# EAGLE design ProtoBIT (EAGLE 7.3.0)
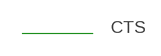
[diagram p0: schematic, sheet 1, part 1 of 2]
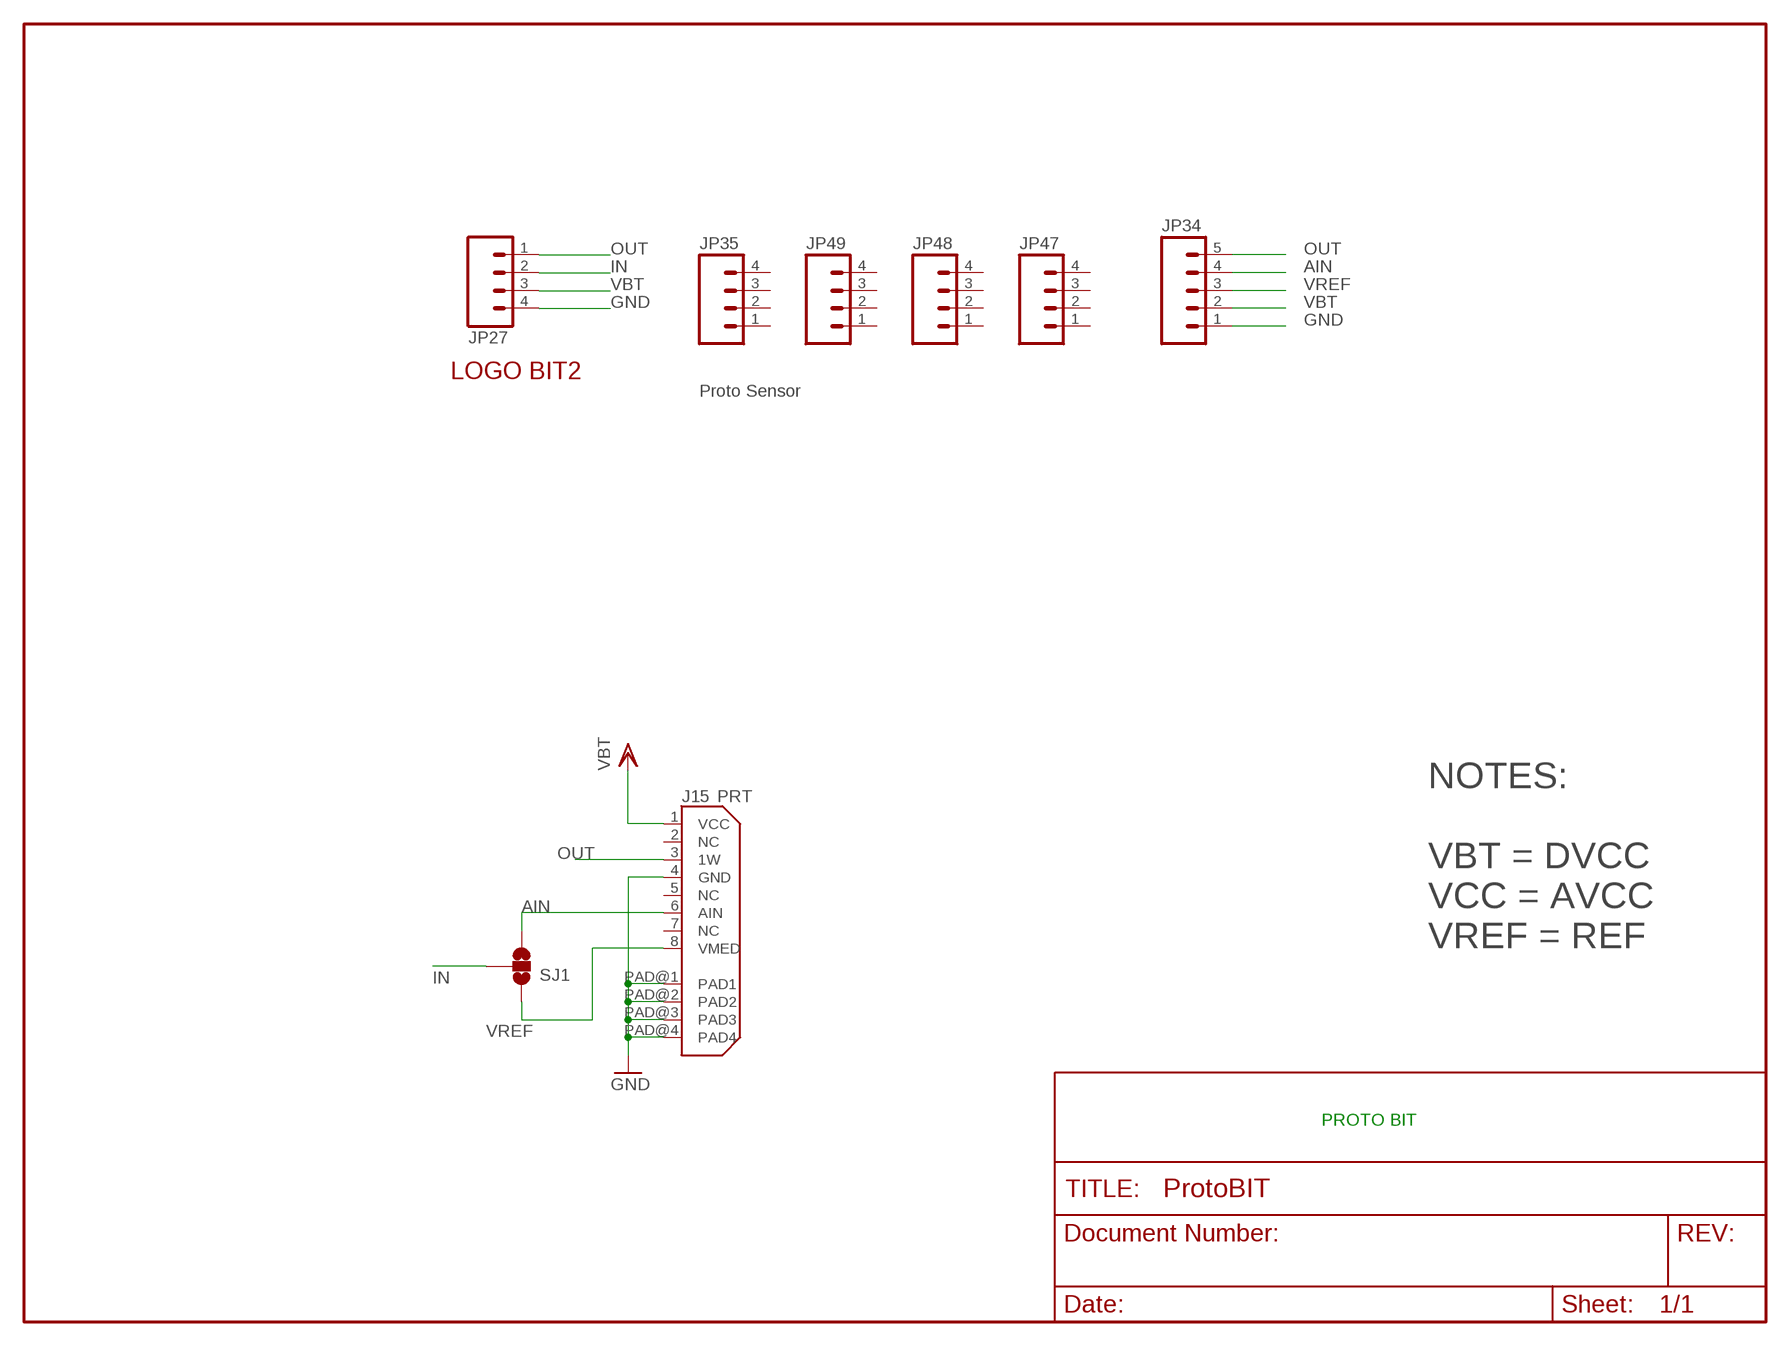
[diagram p1: schematic, sheet 1, part 2 of 2]

## Parts
J15  PRT  ANALOG_CONN_COMTEK_8PINSMD  [8PIN_MINI_USB_SINGLE_ROW_SMD]
JP27  M04JST-PTH  [JST-4-PTH]
JP34  M05  [JST-5-PTH-NO_SILK]
JP35  M04PTH  [1X04]
JP47  M04PTH  [1X04]
JP48  M04PTH  [1X04]
JP49  M04PTH  [1X04]
SJ1  SOLDERJUMPER_2WAYS  [SJ_3]
U$14  LOGO_BIT2(4.72X3.78)  [LOGO_BIT2]

## Nets
AIN: J15.6(AIN) JP34.4 SJ1.3
GND: J15.4(GND) J15.PAD@1(PAD1) J15.PAD@2(PAD2) J15.PAD@3(PAD3) J15.PAD@4(PAD4) JP27.4 JP34.1
IN: JP27.2 SJ1.2
OUT: J15.3(1W) JP27.1 JP34.5
VBT: J15.1(VCC) JP27.3 JP34.2
VREF: J15.8(VMED) JP34.3 SJ1.1
Unconnected: J15.2(NC) J15.5(NC) J15.7(NC) JP35.1 JP35.2 JP35.3 JP35.4 JP47.1 JP47.2 JP47.3 JP47.4 JP48.1 JP48.2 JP48.3 JP48.4 JP49.1 JP49.2 JP49.3 JP49.4

## Notes on the sheet
- Proto Sensor
- NOTES:
  
  VBT = DVCC
  VCC = AVCC
  VREF = REF
- PROTO BIT

## Library data of the parts
J15 = BioPlux2_connectors:ANALOG_CONN_COMTEK_8PIN
JP27 = SparkFun:M04: Header 4 Standard 4-pin 0.1" header. Use with straight break away headers (SKU : PRT-00116), right angle break away headers (PRT-00553), swiss pins (PRT-00743), machine pins (PRT-00117), and female headers (PRT-00115). Molex polarized connector foot print use with SKU : PRT-08231 with associated crimp pins and housings. 1MM SMD Version SKU: PRT-10208
JP34 = SparkFun-Connectors:M05: Header 5 Standard 5-pin 0.1" header. Use with straight break away headers (SKU : PRT-00116), right angle break away headers (PRT-00553), swiss pins (PRT-00743), machine pins (PRT-00117), and female headers (PRT-00115). Molex polarized connector foot print use with SKU : PRT-08230 with associated crimp pins and housings.
JP35 JP47-JP49 = SparkFun-Connectors:M04: Header 4 Standard 4-pin 0.1" header. Use with straight break away headers (SKU : PRT-00116), right angle break away headers (PRT-00553), swiss pins (PRT-00743), machine pins (PRT-00117), and female headers (PRT-00115). Molex polarized connector foot print use with SKU : PRT-08231 with associated crimp pins and housings. 1MM SMD Version SKU: PRT-10208
SJ1 = SparkFun-Retired:SOLDERJUMPER_2WAY: Solder Jumper 2 way solder jumper
U$14 = bit2_logo_27x8:LOGO_BIT2(4.72X3.78)

## Board
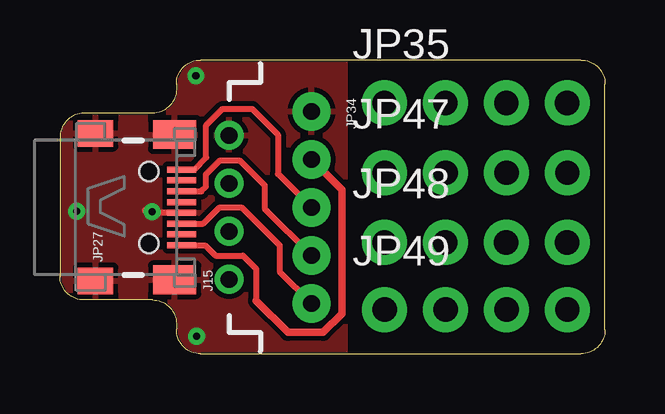
[diagram p2: board, top side]
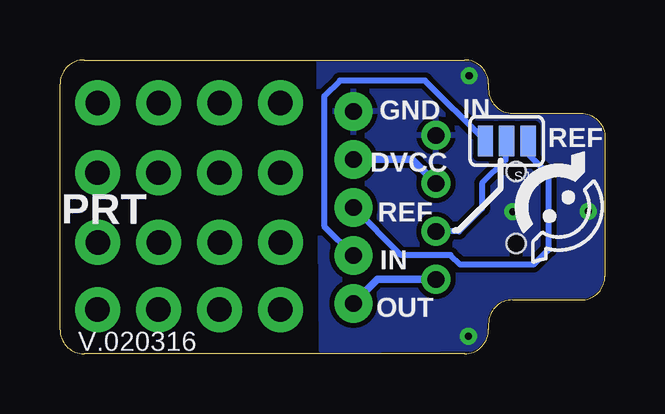
[diagram p3: board, bottom side, seen from below]

Size 22.73 x 12.24 mm. Coordinates in mm from the lower left corner, seen from the top.
Outline: 0,9 arc-90 1,10.02 3.85,10.02 arc90 4.86,11.02 4.86,11.24
Outline: 5.85,0 5.86,0
Outline: 5.86,0 21.73,0 arc90 22.73,1 22.73,11.24 arc90 21.73,12.24 5.86,12.24 arc90 4.86,11.24
Outline: 4.86,11.26 4.86,11.24
Outline: 5.86,0 arc-90 4.86,1.02 4.86,1.25 arc90 3.85,2.25 1,2.25 arc-90 0,3.23
Outline: 0,9.03 0,3.21
Copper layers (1*16): Top 0.035mm / dielectric 1mm / Bottom 0.035mm
Design rules "bitalino *": minimum track width 6mil, minimum drill 8mil, track to track 8mil, track to pad 8mil, pad to pad 8mil, via to via 8mil, smd to smd 8mil, copper to edge 2mil, drill to drill 8mil, minimum pad ring 10mil, minimum via ring 8mil, stop-mask expansion 6mil, vias tented up to drill 15mil, thermal gap 8mil

### Footprints (pad centres in the part's own frame; a part is rotated, then mirrored left to right if it is on the bottom)
8PIN_MINI_USB_SINGLE_ROW_SMD = smd 0.25 x 1.2: 1 -1.574,-1.2; 2 -1.124,-1.2; 3 -0.674,-1.2; 4 -0.224,-1.2; 5 0.226,-1.2; 6 0.676,-1.2; 7 1.126,-1.2; 8 1.576,-1.2 | smd 1.1 x 1.48: PAD@1 -3.061,2.391; PAD@3 3.089,2.391 | smd 1.2 x 1.8: PAD@2 -3.01,-0.9; PAD@4 3.04,-0.9 | hole 0.8: -1.5,0.17; 1.5,0.17
JST-4-PTH = drill 0.7: 1 -3,-5; 2 -1,-5; 3 1,-5; 4 3,-5
JST-5-PTH-NO_SILK = drill 0.7 pad 1.6: 1 -4,0; 2 -2,0; 3 0,0; 4 2,0; 5 4,0
1X04 = drill 1.016 pad 1.88: 1 0,0; 2 2.54,0; 3 5.08,0; 4 7.62,0
SJ_3 = smd 0.635 x 1.27: 1 -0.889,0; 2 0,0; 3 0.889,0

### Placement (x,y rotation side)
J15  3.88,6.1 90 top
JP27  2.06,6.1 90 top
JP34  10.49,6.1 270 top
JP35  13.53,10.46 0 top
JP47  13.54,7.54 0 top
JP48  13.53,4.64 0 top
JP49  13.54,1.84 0 top
SJ1  4.1,8.87 180 bottom
U$14  0.01,3.76 90 bottom

### Tracks (layer width: path | path; a pad name or v marks a point on that pad's centre or on a via)
AIN
  Top 0.254: J15.6 5.89,6.77 6.09,6.97 6.09,7.47 6.68,8.06 7.49,8.06 8.54,7.01 8.54,6.05 JP34.4
  Bottom 0.254: SJ1.3 5.01,8.89 5.08,8.89 5.08,8.97 7.5,11.38 11.06,11.38 11.71,10.73 11.71,5.32 JP34.4
GND  (via drill 0.3)
  Top 0.254: J15.4 3.65,5.87 3.54,5.98
  other vias: 5.7,0.73 5.67,11.58 3.85,5.92 0.7,5.93
  pour Bottom: -0.53,12.16 -0.54,0.26 11.8,0.14 11.91,12.15
  pour Top: -0.55,12.12 -0.5,0.07 11.89,-0.05 11.89,12.16
IN
  Bottom 0.254: SJ1.2 4.14,8.83 4.14,8.08 5.13,7.1 5.13,6.05 6.08,5.1 JP27.2
OUT
  Top 0.254: J15.3 5.98,5.42 6.66,6.1 7.57,6.1 9.16,4.52 9.16,3.43 JP34.5
  Bottom 0.305: JP27.1 9.49,3.1 JP34.5
VBT
  Top 0.254: J15.1 6.05,4.52 6.48,4.09 7.63,4.09 8.18,3.54 8.18,2.21
  Top 0.305: JP34.2 11.76,6.83 11.76,1.67 10.98,0.89 9.51,0.89 8.18,2.21
  Bottom 0.305: JP34.2 8.06,8.1 JP27.3
VREF
  Top 0.254: JP34.3 9.09,7.5 9.09,9.14 8.02,10.21 6.79,10.21 6.1,9.52 6.1,8.19 5.59,7.67 J15.8
  Bottom 0.254: SJ1.1 3.17,8.83 3.17,8.3 2.34,7.47 2.34,4.36 2.98,3.71 6.03,3.71 6.44,4.12 8.51,4.12 JP34.3

### Text on the board
Measures: (22,7x12,25)
_bsilk: IN | GND | REF | DVCC | PRT | REF | IN | OUT | V.020316